# Altium schematic sheet esquematico_placa_micro.SchDoc
size A4; SheetNumber: 1; SheetTotal: 1
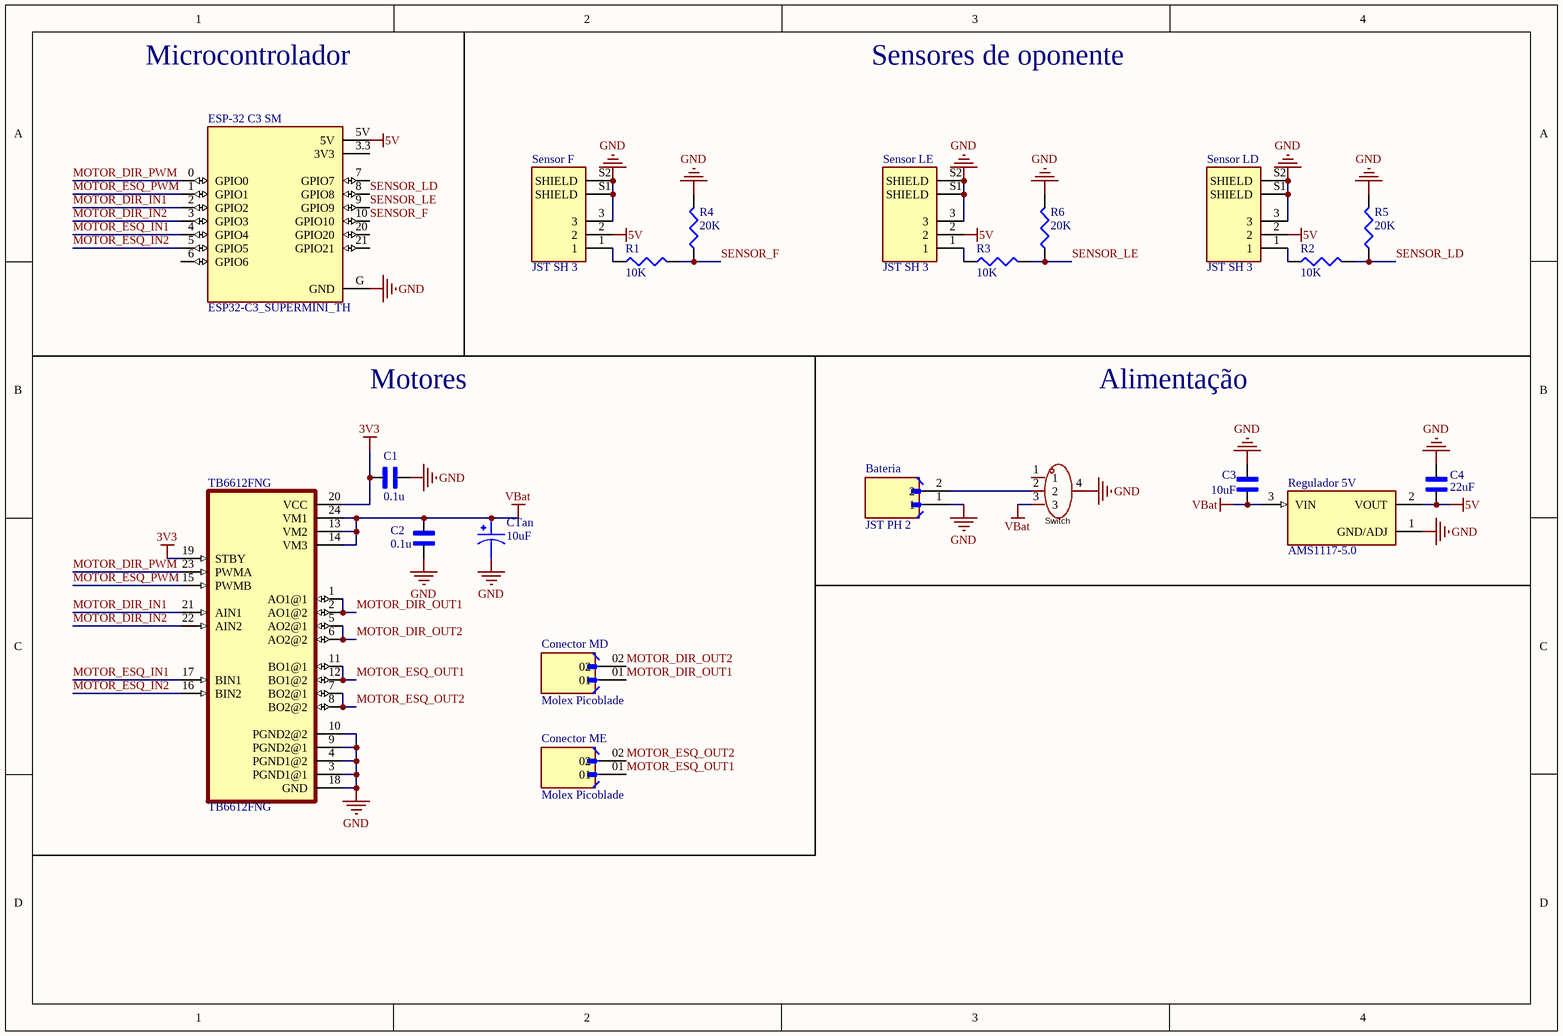
[diagram p0: esquematico_placa_micro.SchDoc]

## Parts
Bateria  JST PH 2  [JST_B2B-PH-K-S(LF)(SN)]
C1  0.1u  [CAPC0603]
C2  0.1u  [CAPC0603]
C3  10uF  [CAPC0603]
C4  22uF  [CAPC0603]
Conector_MD  Molex Picoblade  [MOLEX_53047-0210]
Conector_ME  Molex Picoblade  [MOLEX_53047-0210]
CTan  10uF  [Capacitor Tântalo Case B - 3528]
ESP-32_C3_SM  ESP32-C3_SUPERMINI_TH  [MODULE_ESP32-C3_SUPERMINI]
R1  value 10K  [Resistor SMD 0603]  (hidden comment: Resistor SMD)
R2  value 10K  [Resistor SMD 0603]  (hidden comment: Resistor SMD)
R3  value 10K  [Resistor SMD 0603]  (hidden comment: Resistor SMD)
R4  value 20K  [Resistor SMD 0603]  (hidden comment: Resistor SMD)
R5  value 20K  [Resistor SMD 0603]  (hidden comment: Resistor SMD)
R6  value 20K  [Resistor SMD 0603]  (hidden comment: Resistor SMD)
Regulador_5V  AMS1117-5.0  [AMS1117 5V]
Sensor_F  JST SH 3  [JST_BM03B-SRSS-TB(LF)(SN)]
Sensor_LD  JST SH 3  [JST_BM03B-SRSS-TB(LF)(SN)]
Sensor_LE  JST SH 3  [JST_BM03B-SRSS-TB(LF)(SN)]
Switch  SK-3293S  [SW-SMD_SK-3293S]  (value not drawn)
TB6612FNG  TB6612FNG  [TB6612 SMD]

## Nets
3V3: C1.2 TB6612FNG.19(STBY) TB6612FNG.20(VCC)
5V: C4.1 ESP-32_C3_SM.5V Regulador_5V.2(VOUT) Sensor_F.2 Sensor_LD.2 Sensor_LE.2
GND: Bateria.1 C1.1 C2.1 C3.2 C4.2 CTan.2 ESP-32_C3_SM.G(GND) R4.2 R5.2 R6.2 Regulador_5V.1(GND/ADJ) Sensor_F.3 Sensor_F.S1(SHIELD) Sensor_F.S2(SHIELD) Sensor_LD.3 Sensor_LD.S1(SHIELD) Sensor_LD.S2(SHIELD) Sensor_LE.3 Sensor_LE.S1(SHIELD) Sensor_LE.S2(SHIELD) Switch.4(EH) TB6612FNG.3(PGND1@1) TB6612FNG.4(PGND1@2) TB6612FNG.9(PGND2@1) TB6612FNG.10(PGND2@2) TB6612FNG.18(GND)
VBat: C2.2 C3.1 CTan.1 Regulador_5V.3(VIN) Switch.3 TB6612FNG.13(VM2) TB6612FNG.14(VM3) TB6612FNG.24(VM1)
MOTOR_DIR_IN1: ESP-32_C3_SM.2(GPIO2) TB6612FNG.21(AIN1)
MOTOR_DIR_IN2: ESP-32_C3_SM.3(GPIO3) TB6612FNG.22(AIN2)
MOTOR_DIR_OUT1: Conector_MD.01 TB6612FNG.1(AO1@1) TB6612FNG.2(AO1@2)
MOTOR_DIR_OUT2: Conector_MD.02 TB6612FNG.5(AO2@1) TB6612FNG.6(AO2@2)
MOTOR_DIR_PWM: ESP-32_C3_SM.0(GPIO0) TB6612FNG.23(PWMA)
MOTOR_ESQ_IN1: ESP-32_C3_SM.4(GPIO4) TB6612FNG.17(BIN1)
MOTOR_ESQ_IN2: ESP-32_C3_SM.5(GPIO5) TB6612FNG.16(BIN2)
MOTOR_ESQ_OUT1: Conector_ME.01 TB6612FNG.11(BO1@1) TB6612FNG.12(BO1@2)
MOTOR_ESQ_OUT2: Conector_ME.02 TB6612FNG.7(BO2@1) TB6612FNG.8(BO2@2)
MOTOR_ESQ_PWM: ESP-32_C3_SM.1(GPIO1) TB6612FNG.15(PWMB)
SENSOR_F: ESP-32_C3_SM.10(GPIO10) R1.2 R4.1
SENSOR_LD: ESP-32_C3_SM.8(GPIO8) R2.2 R5.1
SENSOR_LE: ESP-32_C3_SM.9(GPIO9) R3.2 R6.1
NetBateria_2: Bateria.2 Switch.2
NetR1_1: R1.1 Sensor_F.1
NetR2_1: R2.1 Sensor_LD.1
NetR3_1: R3.1 Sensor_LE.1

Not connected (* = marked no-connect by the designer): ESP-32_C3_SM 3.3(3V3) 6(GPIO6) 7(GPIO7) 20(GPIO20) 21(GPIO21); Switch 1

## Notes on the sheet
- Microcontrolador
- Sensores de oponente
- Motores
- Alimentação

## Library data of the parts
Bateria = B2B-PH-K-S(LF)(SN): Connector Header Through Hole 2 position 0.079 (2.00mm); SnapEDA_Link: https://www.snapeda.com/parts/B2B-PH-K-S%20(LF)(SN)/JST/view-part/?ref=snap; Package: None; Value: *; MF: JST; MP: B2B-PH-K-S (LF)(SN); Check_prices: https://www.snapeda.com/parts/B2B-PH-K-S%20(LF)(SN)/JST/view-part/?ref=eda
C1-C4 = Capacitor SMD: 0805 390 pF 50 V Â±5% Tolerance C0G SMT Multilayer Ceramic Capacitor; MF: Murata Electronics; MP: GRM2165C1H391JA01D; Price: 0.07 USD; SnapEDA_Link: https://www.snapeda.com/parts/GRM2165C1H391JA01D/Murata%2520Electronics%2520North%2520America/view-part/?ref=snap; Availability: Good; Package: 0805 Murata; Value: *
Conector_MD Conector_ME = 53047-0210: Picoblade Connector, 2 Circuit Single Row, Vertical Throughole PCB; MP: 0530470210; SnapEDA_Link: https://www.snapeda.com/parts/0530470210/Molex/view-part/?ref=snap; Package: None; Value: *; MF: Molex; Check_prices: https://www.snapeda.com/parts/0530470210/Molex/view-part/?ref=eda
CTan = Capacitor Tantalo: 10µF Molded Tantalum Capacitors 10V 2.5Ohm; MP: TAJC106K010RNJ; MF: AVX; Package: 2312 AVX; Purchase-URL: https://pricing.snapeda.com/search/part/TAJC106K010RNJ/?ref=eda; Price: None; Availability: Warning; SnapEDA_Link: https://www.snapeda.com/parts/TAJC106K010RNJ/AVX/view-part/1685649/?ref=snap; Value: *
ESP-32_C3_SM = ESP32-C3_SUPERMINI_TH: Super tiny ESP32-C3 board; MF: Espressif Systems; MP: ESP32-C3 SuperMini_TH; SnapEDA_Link: https://www.snapeda.com/parts/ESP32-C3%20SuperMini_TH/Espressif+Systems/view-part/?ref=snap; Package: Package; Value: *; Check_prices: https://www.snapeda.com/parts/ESP32-C3%20SuperMini_TH/Espressif+Systems/view-part/?ref=eda
R1-R6 = Resistor SMD: Resistor SMD com os tamanhos 0603, 0805, 1206 e 1210; Size: 0603
Regulador_5V = AMS1117-5.0: 1A LOW DROPOUT VOLTAGE REGULATOR; MF: ams; MP: AMS1117-5.0; Package: SOT-223 Seeed Technology; SnapEDA_Link: https://www.snapeda.com/parts/AMS1117-5.0/ams/view-part/?ref=snap; Check_prices: https://www.snapeda.com/parts/AMS1117-5.0/ams/view-part/?ref=eda; Availability: Not in stock; Value: *; Price: None
Sensor_F Sensor_LD Sensor_LE = BM03B-SRSS-TB(LF)(SN): Connector Header Surface Mount 3 position 0.039 (1.00mm); MF: JST Sales; SnapEDA_Link: https://www.snapeda.com/parts/BM03B-SRSS-TB(LF)(SN)/JST/view-part/?ref=snap; Package: None; Value: *; MP: BM03B-SRSS-TB(LF)(SN); Check_prices: https://www.snapeda.com/parts/BM03B-SRSS-TB(LF)(SN)/JST/view-part/?ref=eda
Switch = SK-3293S: Manufacturer: XKB Connectivity(中国星坤); Add into BOM: yes; Circuit: SPDT; Actuator Style: Rectangular columnar; Pin Style: SMDSplicing; Switch Length: 6mm; Switch Width: 2.75mm; Switch Height: 1.4mm; Actuator Color: White; Current Rating (DC): 50mA; Voltage Rating (DC): 12V; Mechanical Life: 1万次; Symbol: SK-3293S; Device: SK-3293S; LCSC Part Name: 柄长1.4mm 卧贴双档 滑动开关; Supplier Part: C466006; Manufacturer Part: SK-3293S; Supplier Footprint: SMD; JLCPCB Part Class: Extended Part; Datasheet: https://atta.szlcsc.com/upload/public/pdf/source/20211011/4EA3EA25F9F21B5CC9E3D39CE49F5B8E.pdf; Supplier: LCSC; Convert to PCB: yes; Mounting Style: 卧贴; Current Rating (AC): 50mA; Voltage Rating (AC): 12V; Operating Temperature: -40℃~+85℃
TB6612FNG = TB6612FNG(O,C,8,EL: DC Motor Driver 3V 24-Pin SSOP T/R; MF: Toshiba; Check_prices: https://www.snapeda.com/parts/TB6612FNG(O,C,8,EL/Toshiba/view-part/?ref=eda; Package: SSOP-24 Toshiba; Availability: Not in stock; Value: *; MP: TB6612FNG(O,C,8,EL; SnapEDA_Link: https://www.snapeda.com/parts/TB6612FNG(O,C,8,EL/Toshiba/view-part/?ref=snap; Price: None